# EAGLE design cameralight (EAGLE 6.4)
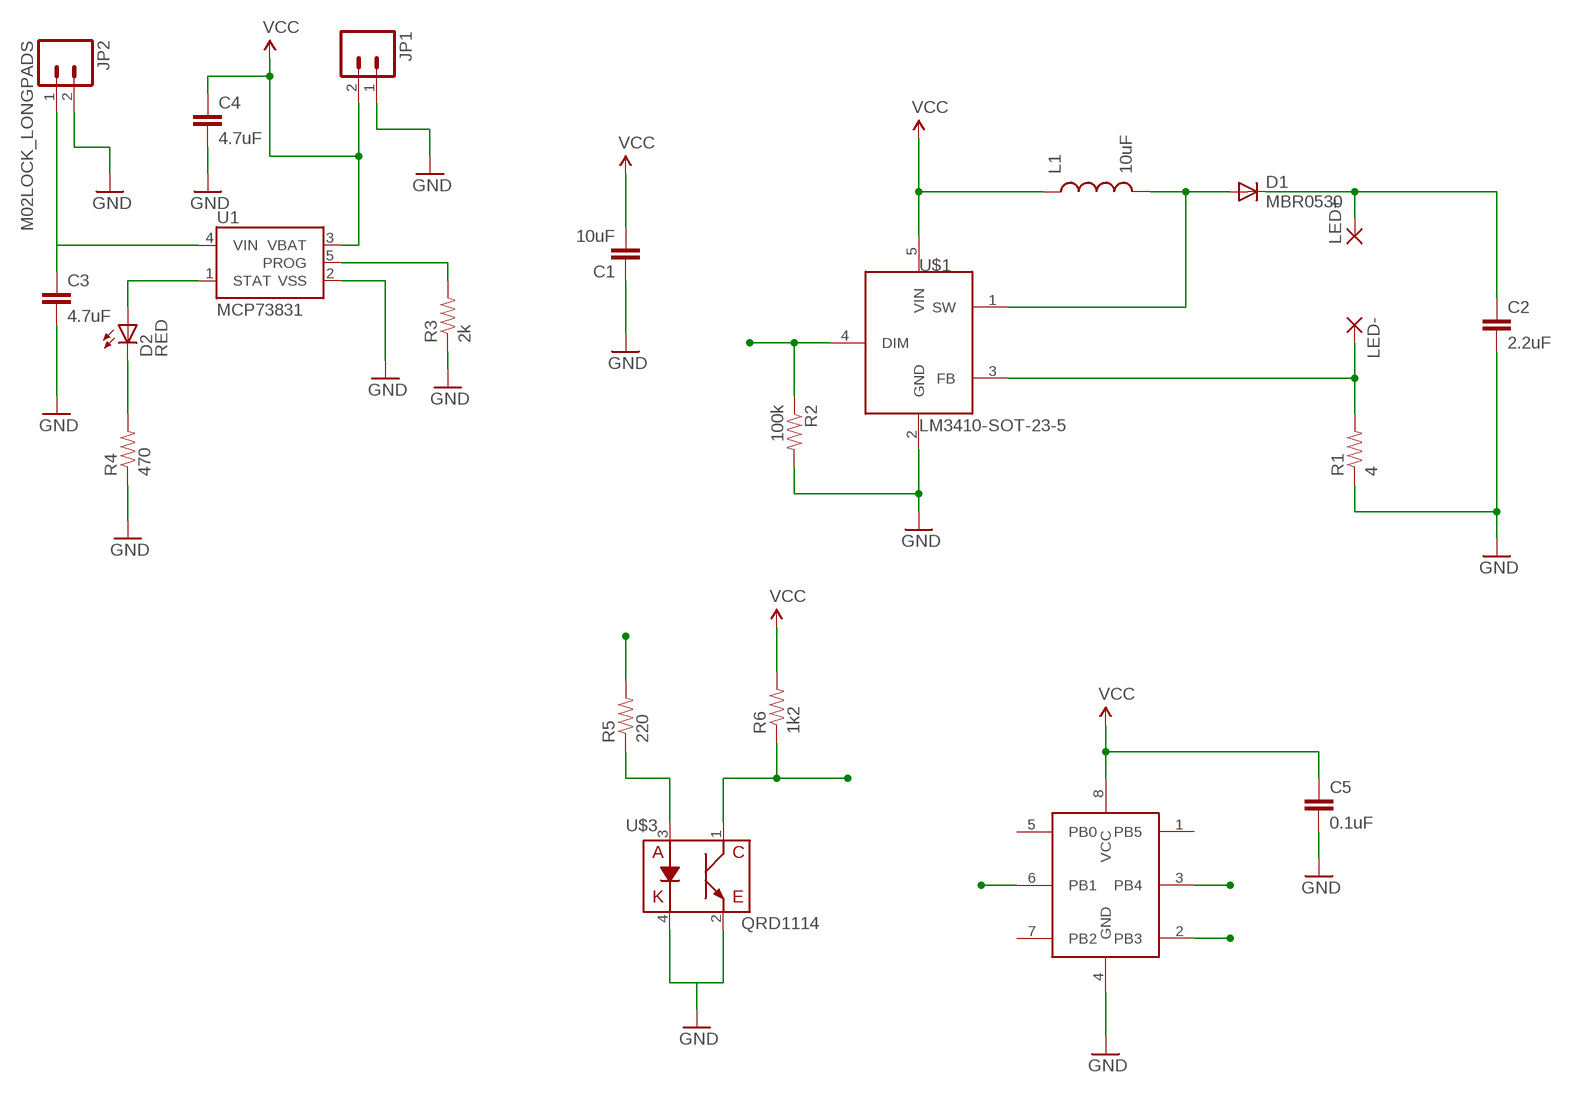
[diagram p0: schematic, sheet 1]

## Parts
C1  10uF  CAPASMD  [CTZ3]
C2  2.2uF  CAPASMD  [CTZ3]
C3  4.7uF  CAP1206  [1206]
C4  4.7uF  CAP1206  [1206]
C5  0.1uF  CAP0603-CAP  [0603-CAP]
D1  MBR0530  MBR0520LT  [SOD123]
D2  RED  LED-RED0603  [LED-0603]
JP1  M02-JST-2MM-SMT  [JST-2-SMD]
JP2  M02LOCK_LONGPADS  [1X02_LOCK_LONGPADS]
L1  10uF  INDUCTORCR54  [CR54]
LED+  2,54/1,0  [2,54/1,0]
LED-  2,54/1,0  [2,54/1,0]
R1  4  RESISTOR0603-RES  [0603-RES]
R2  100k  RESISTOR0603-RES  [0603-RES]
R3  2k  RESISTOR1206  [1206]
R4  470  RESISTOR0603-RES  [0603-RES]
R5  220  RESISTOR0603-RES  [0603-RES]
R6  1k2  RESISTOR0603-RES  [0603-RES]
U1  MCP73831  [SOT23-5]
U$1  LM3410-SOT-23-5  [SOT-23-5]
U$2  ATTINY13  [WSOIC-8]
U$3  QRD1114  [QRD1114]

## Nets
DIM: R2.1 U$1.4(DIM) U$2.6(PB1)
GND: C1.+ C2.- C3.2 C4.2 C5.2 JP1.1 JP2.2 R1.1 R2.2 R3.1 R4.1 U1.2(VSS) U$1.2(GND) U$2.4(GND) U$3.2(C) U$3.4(K)
LED+: C2.+ D1.C LED+.1(P)
LED-: LED-.1(P) R1.2 U$1.3(FB)
N$2: D1.A L1.P$2 U$1.1(SW)
N$3: R3.2 U1.5(PROG)
N$12: D2.A U1.1(STAT)
N$13: D2.C R4.2
N$15: C3.1 JP2.1 U1.4(VIN)
N$19: R5.1 U$3.3(A)
PROX_EN: R5.2 U$2.2(PB3)
PROX_SNS: R6.1 U$2.3(PB4) U$3.1(E)
VCC: C1.- C4.1 C5.1 JP1.2 L1.P$1 R6.2 U1.3(VBAT) U$1.5(VIN) U$2.8(VCC)
Unconnected: U$2.1(PB5) U$2.5(PB0) U$2.7(PB2)

## Library data of the parts
C1 C2 = SparkFun-Passives:CAP: Capacitor Standard 0603 ceramic capacitor, and 0.1" leaded capacitor.
C3-C5 = SparkFun-Capacitors:CAP: Capacitor Standard 0603 ceramic capacitor, and 0.1" leaded capacitor.
D1 = diode:MBR0520LT: SCHOTTKY BARRIER RECTIFIER Source: http://onsemi.com .. MBR0520LT1-D.pdf
D2 = SparkFun-LED:LED-RED: Assorted Red LEDs LilyPad 1206- DIO-09912 1206- DIO-00809 0603- DIO-00819; PROD_ID: DIO-00819
JP1 = SparkFun-Connectors:M02: Standard 2-pin 0.1" header. Use with - straight break away headers ( PRT-00116) - right angle break away headers (PRT-00553) - swiss pins (PRT-00743) - machine pins (PRT-00117) - female headers (PRT-00115) Molex polarized connector foot print use with: PRT-08233 with associated crimp pins and housings. 2.54_SCREWTERM for use with PRT-10571. 3.5mm Screw Terminal footprints for PRT-08084 5mm Screw Terminal footprints for use with PRT-08433; PROD_ID: CONN-08352
JP2 = SparkFun-Connectors:M02: Standard 2-pin 0.1" header. Use with - straight break away headers ( PRT-00116) - right angle break away headers (PRT-00553) - swiss pins (PRT-00743) - machine pins (PRT-00117) - female headers (PRT-00115) Molex polarized connector foot print use with: PRT-08233 with associated crimp pins and housings. 2.54_SCREWTERM for use with PRT-10571. 3.5mm Screw Terminal footprints for PRT-08084 5mm Screw Terminal footprints for use with PRT-08433
L1 = SparkFun-Passives:INDUCTOR: Inductors Basic Inductor/Choke - 0603 and 1206. Footprints are not proven and vary greatly between part numbers.
LED+ LED- = wirepad:2,54/1,0: THROUGH-HOLE PAD
R1-R6 = SparkFun-Resistors:RESISTOR: Resistor Basic schematic elements and footprints for 0603, 1206, and PTH resistors.
U1 = SparkFun-PowerIC:MCP73831: Miniature single cell, fully integrated Li-Ion, Li-polymer charge management controller http://ww1.microchip.com/downloads/en/DeviceDoc/21984a.pdf IC-09995; PROD_ID: IC-09995
U$1 = Synapseware:LM3410: LM3410/LM3410Q 525kHz/1.6MHz, Constant Current Boost and SEPIC LED Driver with Internal Compensation
U$2 = Synapseware:ATTINY13: The ATtiny13 is a low-power CMOS 8-bit microcontroller based on the AVR enhanced RISC architecture. By executing powerful instructions in a single clock cycle, the ATtiny13 achieves throughputs approaching 1 MIPS per MHz allowing the system designer to optimize power consumption versus processing speed.
U$3 = SparkFun-Sensors:QRD1114: Reflective object sensor

## Board
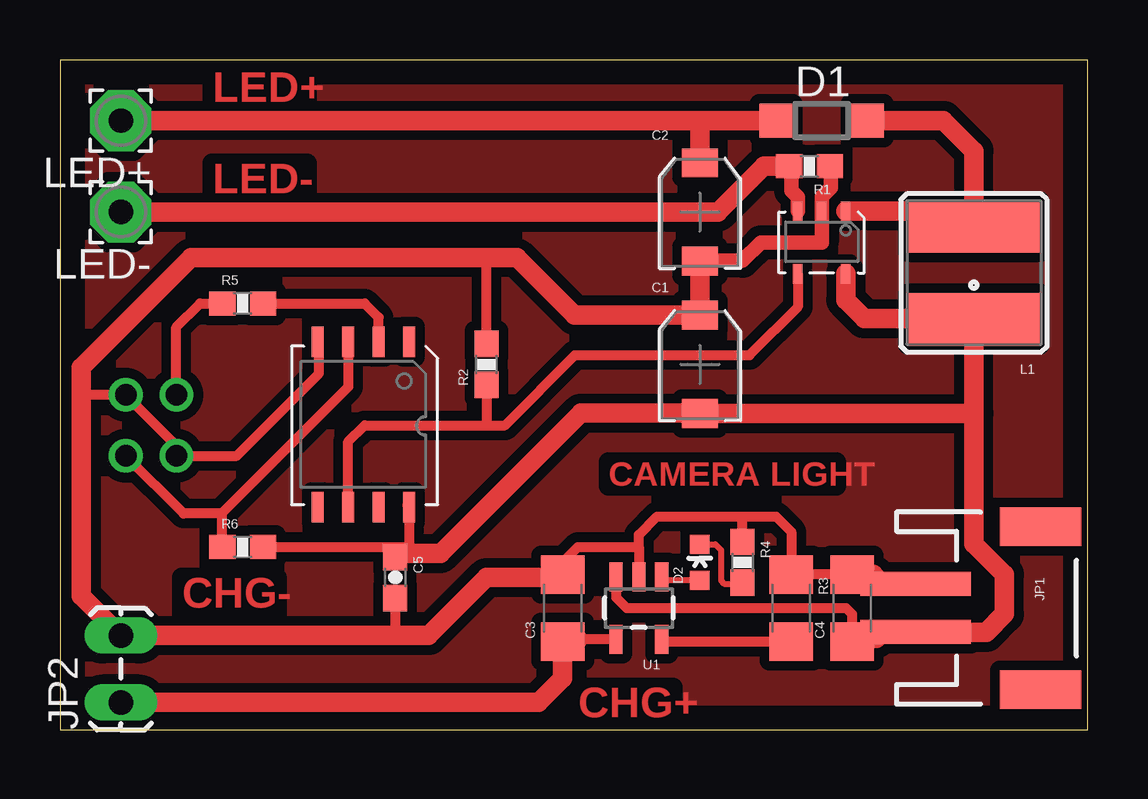
[diagram p1: board, top side]
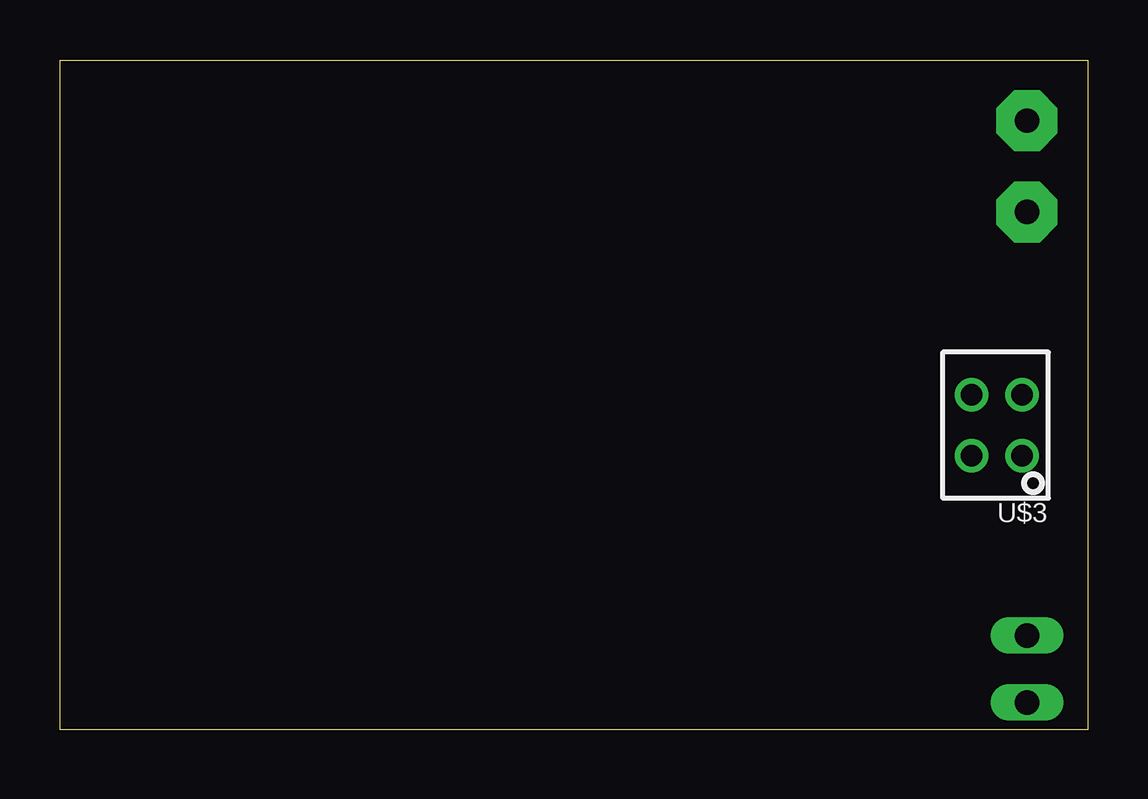
[diagram p2: board, bottom side, seen from below]

Size 42.85 x 27.93 mm. Coordinates in mm from the lower left corner, seen from the top.
Outline: 0,0 42.85,0 42.85,27.93 0,27.93 0,0
Copper layers (1*16): Top 0.035mm / dielectric 1.5mm / Bottom 0.035mm
Design rules "default": minimum track width 10mil, minimum drill 0.6mm, track to track 8mil, track to pad 8mil, pad to pad 8mil, via to via 8mil, smd to smd 8mil, copper to edge 40mil, drill to drill 8mil, minimum pad ring 10mil, minimum via ring 8mil, stop-mask expansion 4mil, vias tented up to drill 0mil, thermal gap 10mil

### Footprints (pad centres in the part's own frame; a part is rotated, then mirrored left to right if it is on the bottom)
CTZ3 = smd 1.5 x 1.2: + 0,2.05; - 0,-2.05
1206 = smd 1.6 x 1.8: 1 -1.4,0; 2 1.4,0
0603-CAP = smd 1.1 x 1: 1 -0.85,0; 2 0.85,0
SOD123 = smd 1.4 x 1.4: A 1.9,0; C -1.9,0
LED-0603 = smd 0.8 x 0.8: A 0,-0.75; C 0,0.75
JST-2-SMD = smd 1 x 4.6: 1 -1,-3.7; 2 1,-3.7 | smd 1.6 x 3.4: NC1 -3.4,1.5; NC2 3.4,1.5
1X02_LOCK_LONGPADS = drill 1.016 long: 1 -0.127,0; 2 2.667,0
CR54 = smd 5.5 x 2.15: P$1 0,1.92; P$2 0,-1.92
2,54/1,0 = drill 1.016 pad 2.54 octagon: 1 0,0
0603-RES = smd 1.1 x 1: 1 -0.85,0; 2 0.85,0
SOT23-5 = smd 0.55 x 1.2: 1 -0.95,-1.3; 2 0,-1.3; 3 0.95,-1.3; 4 0.95,1.3; 5 -0.95,1.3
SOT-23-5 = smd 0.406 x 0.813: 1 -1,-1.3; 2 0,-1.3; 3 1,-1.3; 4 1,1.3; 5 -1,1.3
WSOIC-8 = smd 0.508 x 1.27: 1 -1.855,-3.486; 2 -0.585,-3.486; 3 0.685,-3.486; 4 1.955,-3.486; 5 1.955,3.413; 6 0.685,3.413; 7 -0.585,3.413; 8 -1.855,3.413
QRD1114 = drill 0.9: 1 -1.067,1.27; 2 -1.067,-1.27; 3 1.041,-1.27; 4 1.041,1.27

### Placement (x,y rotation side)
C1  26.67,15.24 0 top
C2  26.67,21.59 0 top
C3  20.95,5.08 90 top
C4  33.02,5.08 90 top
C5  13.97,6.35 270 top
D1  31.75,25.4 0 top
D2  26.67,6.99 0 top
JP1  39.37,5.08 270 top
JP2  2.54,1.27 90 top
L1  38.1,19.05 180 top
LED+  2.54,25.4 180 top
LED-  2.54,21.59 180 top
R1  31.24,23.5 180 top
R2  17.78,15.24 90 top
R3  30.48,5.08 270 top
R4  28.45,6.99 270 top
R5  7.62,17.78 0 top
R6  7.62,7.62 0 top
U1  24.13,5.08 180 top
U$1  31.75,20.32 180 top
U$2  12.7,12.7 180 top
U$3  3.81,12.7 180 bottom

### Tracks (layer width: path | path; a pad name or v marks a point on that pad's centre or on a via)
DIM
  Top 0.406: U$2.6 12.02,12.02 12.7,12.7 17.78,12.7 | 17.78,12.7 18.54,12.7 21.46,15.62 28.74,15.62 30.75,17.63 U$1.4 | R2.1 17.78,12.7
GND
  Top 0.406: 10.74,15.82 U$2.4 10.79,16.14 10.79,14.86 7.37,11.43 U$3.4 4.85,11.86 U$3.2 0.89,13.97 | 33.15,6.35 C4.2 | C4.2 R3.1 30.48,8.26 29.84,8.89 28.45,8.89 | C4.2 33.02,6.6 33.15,6.73 | C3.2 20.95,6.99 21.59,7.62 24.13,7.62 | 24.13,7.62 U1.2 | 24.13,7.62 24.13,8.13 24.89,8.89 28.45,8.89 | R4.1 28.45,8.89 | 11.85,4.03 11.94,3.94 | C5.2 13.97,3.94 | 32.13,23.46 R1.1 | R2.2 17.78,19.56 17.91,19.68
  Top 0.61: C3.2 | 32.13,23.46 32.13,22.61 31.75,22.23 U$1.2 31.75,20.32 29.21,20.32 28.45,19.56 26.69,19.56 C2.-
  Top 0.813: C3.2 20.82,6.35 17.78,6.35 15.37,3.94 13.97,3.94 11.94,3.94 JP2.2 0.89,5.59 0.89,13.97 0.89,15.11 5.46,19.68 17.91,19.68 19.05,19.68 21.45,17.29 C1.+ C2.- | JP1.1 34.31,6.08 33.91,6.48 C4.2
LED+
  Top 0.813: C2.+ 26.67,25.27 26.61,25.34 | 26.61,25.34 26.54,25.4 LED+.1 | D1.C 26.67,25.4 26.61,25.34
LED-
  Top 0.406: 30.48,23.41 R1.2
  Top 0.61: U$1.3 30.75,22.21 30.48,22.48 30.48,23.41
  Top 0.813: LED-.1 27.43,21.59 29.34,23.5 R1.2
N$1
  pour Top (isolate 0.406): 0,0 43.18,0 43.18,27.94 0,27.94
N$2
  Top 0.406: 37.77,21.62 L1.P$2
  Top 0.813: L1.P$2 38.1,24.13 36.83,25.4 D1.A | 37.77,21.62 U$1.1
N$3
  Top 0.406: R3.2 25.18,3.68 U1.5
N$12
  Top 0.254: D2.A 25.23,6.24 U1.1
  Top 0.406: 25.02,6.44 U1.1
N$13
  Top 0.254: D2.C 27.32,7.74 27.56,7.49 27.56,6.22 27.69,6.1 28.41,6.1 R4.2
N$15
  Top 0.406: U1.4 21.59,3.78 21.05,3.78 C3.1
  Top 0.813: JP2.1 19.94,1.14 20.95,2.16 20.95,3.15 21.59,3.78
N$19
  Top 0.406: U$3.3 4.85,16.79 5.84,17.78 R5.1
PROX_EN
  Top 0.406: U$2.2 13.29,17.2 12.7,17.78 R5.2
PROX_SNS
  Top 0.406: U$2.3 12.02,14.3 6.73,9.02 | 6.73,9.02 6.73,7.66 R6.1 | 6.73,9.02 5.16,9.02 U$3.1
VCC
  Top 0.406: 14.48,9.36 U$2.8 14.55,7.62 | 14.55,7.62 14.55,7.36 | 26.58,13.1 C1.- | R6.2 14.1,7.62 | 14.1,7.62 14.55,7.62 | U1.3 23.18,5.52 23.62,5.08 32.77,5.08 33.02,4.83 C4.1 | C5.1 13.97,7.49 14.1,7.62
  Top 0.61: 35.69,4.06 JP1.2 | 26.56,13.08 C1.-
  Top 0.813: JP1.2 34.31,4.08 34.04,3.81 33.15,3.81 C4.1 | 35.69,4.06 38.61,4.06 39.37,4.83 39.37,6.48 38.1,7.75 38.1,13.21 | 38.1,13.21 L1.P$1 38.09,17.14 33.53,17.14 32.75,17.92 U$1.5 | 38.1,13.21 38.08,13.19 C1.- 26.65,13.21 21.72,13.21 15.86,7.36 14.55,7.36

### Text on the board
Top: LED+ | LED- | CAMERA LIGHT | CHG- | CHG+